# EAGLE design Adapter6 (EAGLE 7.7.0)
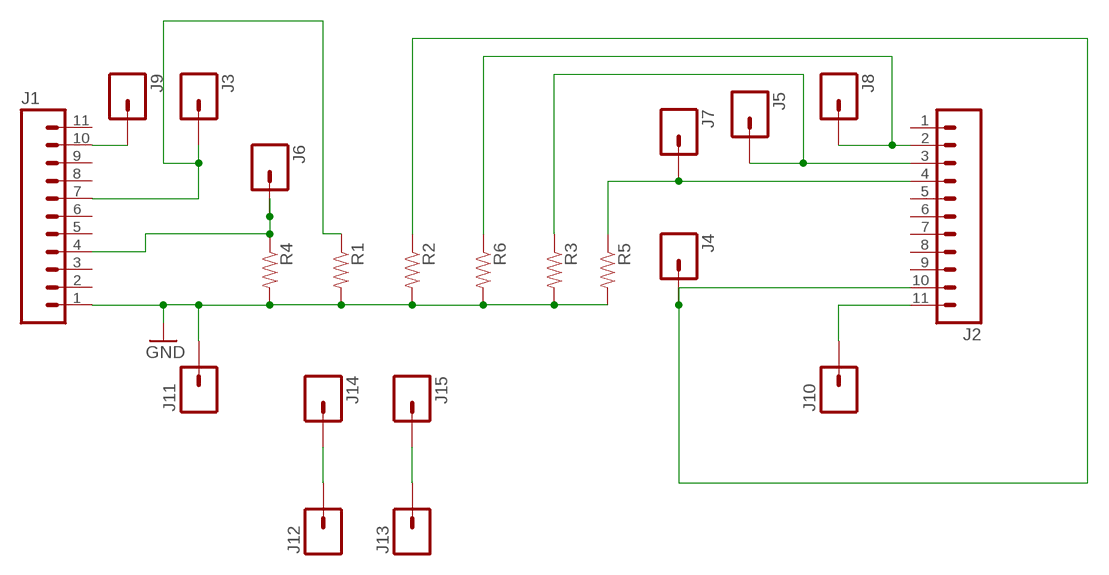
[diagram p0: schematic, sheet 1]

## Parts
J1  M11PTH  [1X11]
J2  M11PTH  [1X11]
J3  M01PTH_2MM  [1X01_2MM]
J4  M01PTH_2MM  [1X01_2MM]
J5  M01PTH_2MM  [1X01_2MM]
J6  M01PTH_2MM  [1X01_2MM]
J7  M01PTH_2MM  [1X01_2MM]
J8  M01PTH_2MM  [1X01_2MM]
J9  M01PTH_2MM  [1X01_2MM]
J10  M01PTH_NO_SILK_YES_STOP  [1X01_NO_SILK]
J11  M01PTH_NO_SILK_YES_STOP  [1X01_NO_SILK]
J12  M01PTH_2MM  [1X01_2MM]
J13  M01PTH_2MM  [1X01_2MM]
J14  M01PTH_NO_SILK_YES_STOP  [1X01_NO_SILK]
J15  M01PTH_NO_SILK_YES_STOP  [1X01_NO_SILK]
R1  RESISTOR1206  [1206]
R2  RESISTOR1206  [1206]
R3  RESISTOR1206  [1206]
R4  RESISTOR1206  [1206]
R5  RESISTOR1206  [1206]
R6  RESISTOR1206  [1206]

## Nets
GND: J1.1 J11.1 R1.2 R2.2 R3.2 R4.2 R5.2 R6.2
N$1: J2.10 J4.1 R2.1
N$2: J1.4 J6.1 R4.1
N$3: J2.11 J10.1
N$4: J2.4 J7.1 R5.1
N$5: J2.3 J5.1 R3.1
N$6: J2.2 J8.1 R6.1
N$7: J1.10 J9.1
N$8: J1.7 J3.1 R1.1
N$9: J12.1 J14.1
N$10: J13.1 J15.1
Unconnected: J1.2 J1.3 J1.5 J1.6 J1.8 J1.9 J1.11 J2.1 J2.5 J2.6 J2.7 J2.8 J2.9

## Library data of the parts
J1 J2 = SparkFun-Connectors:M11: Header 11 Standard 11-pin 0.1" header. Use with straight break away headers (SKU : PRT-00116), right angle break away headers (PRT-00553), swiss pins (PRT-00743), machine pins (PRT-00117), and female headers (PRT-00115).
J3-J15 = SparkFun-Connectors:M01: Header 1 Standard 1-pin 0.1" header. Use with straight break away headers (SKU : PRT-00116), right angle break away headers (PRT-00553), swiss pins (PRT-00743), machine pins (PRT-00117), and female headers (PRT-00115). SMTSO-256-ET is a "flush mount" nut for a 4-40 screw. The older package used to be too tight, and did not allow it to sit properly thru the drill hit. The latest (0.165DIA) fits nice and snug.
R1-R6 = SparkFun-Passives:RESISTOR: Resistor Basic schematic elements and footprints for 0603, 1206, and PTH resistors.

## Board
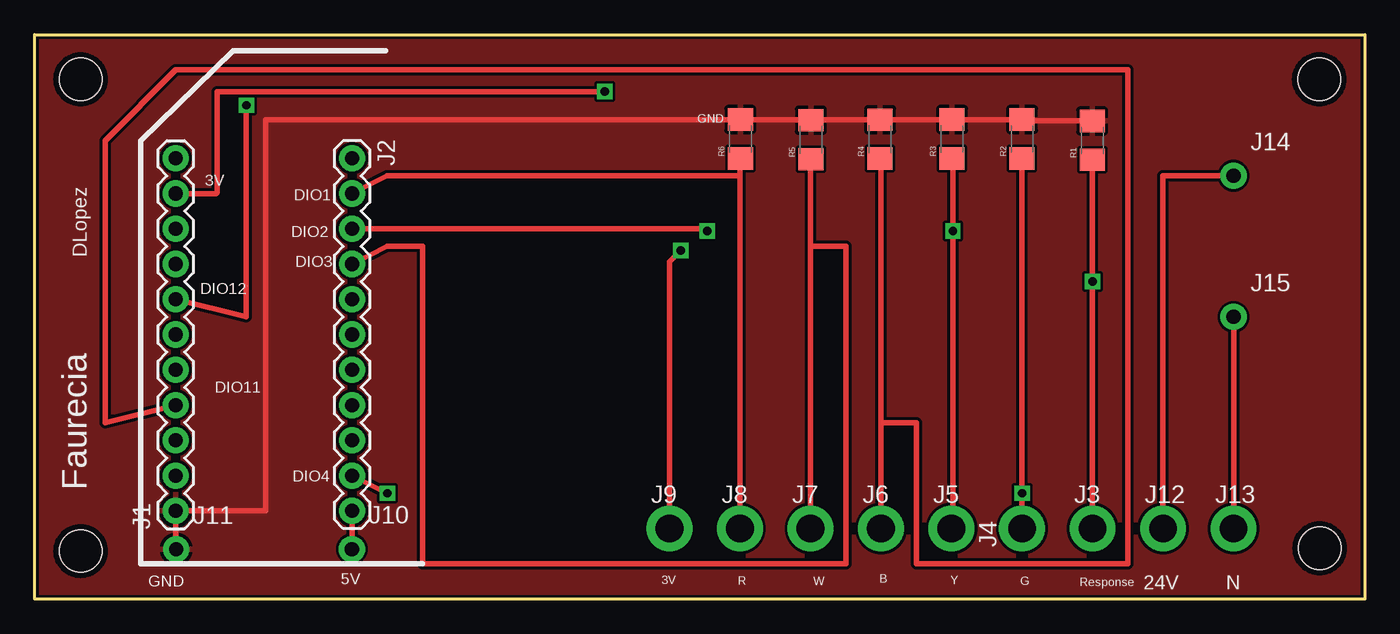
[diagram p1: board, top side]
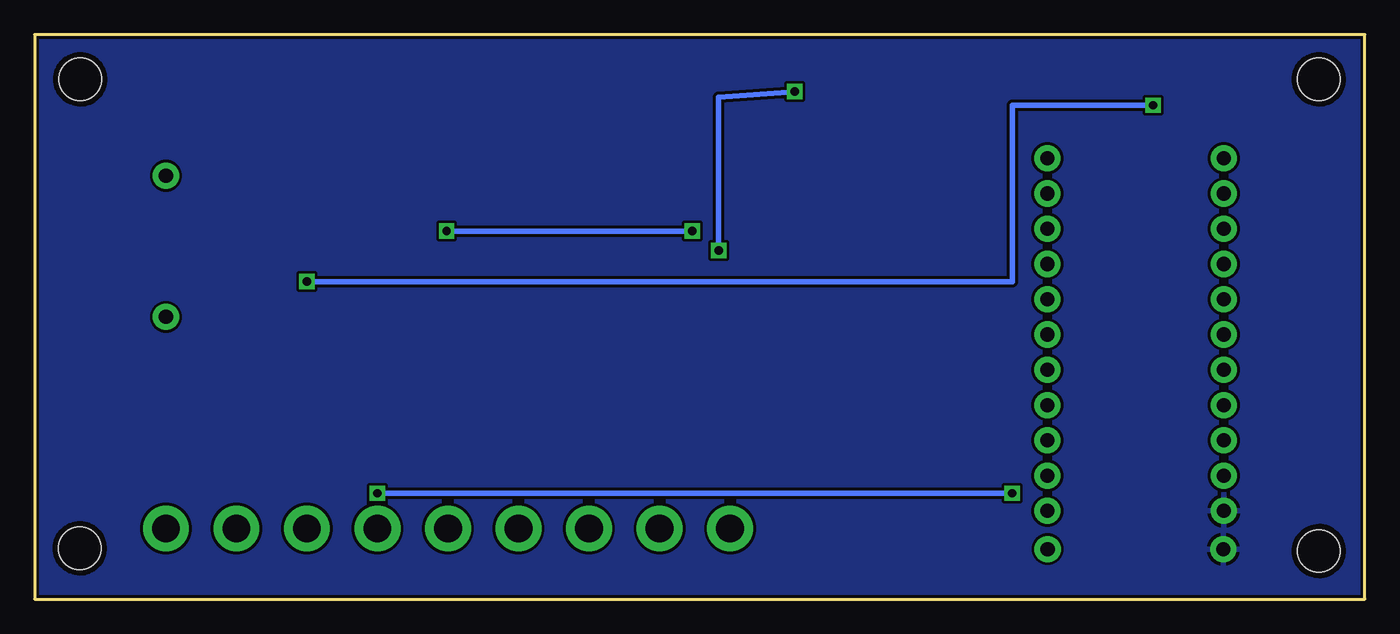
[diagram p2: board, bottom side, seen from below]

Size 95.81 x 40.64 mm. Coordinates in mm from the lower left corner, seen from the top.
Outline: 0,0 0,40.64 95.81,40.64 95.81,0 0,0
Copper layers (1*16): Top 0.035mm / dielectric 1.5mm / Bottom 0.035mm
Design rules "SparkFun": minimum track width 8mil, minimum drill 20mil, track to track 8mil, track to pad 8mil, pad to pad 8mil, via to via 8mil, smd to smd 8mil, copper to edge 8mil, drill to drill 8mil, minimum pad ring 12mil, minimum via ring 10mil, stop-mask expansion 4mil, vias tented up to drill 20mil, thermal gap 10mil

### Footprints (pad centres in the part's own frame; a part is rotated, then mirrored left to right if it is on the bottom)
1X11 = drill 1.016 pad 1.88: 1 0,0; 2 2.54,0; 3 5.08,0; 4 7.62,0; 5 10.16,0; 6 12.7,0; 7 15.24,0; 8 17.78,0; 9 20.32,0; 10 22.86,0; 11 25.4,0
1X01_2MM = drill 2 pad 3.302: 1 0,0
1X01_NO_SILK = drill 1.016 pad 1.88: 1 0,0
1206 = smd 1.6 x 1.8: 1 -1.4,0; 2 1.4,0
STAND-OFF-TIGHT = hole 3.048: 0,0

### Placement (x,y rotation side)
J1  10.16,6.35 90 top
J2  22.86,31.75 270 top
J3  76.2,5.08 0 top
J4  71.12,5.08 90 top
J5  66.04,5.08 0 top
J6  60.96,5.08 0 top
J7  55.88,5.08 0 top
J8  50.8,5.08 0 top
J9  45.72,5.08 0 top
J10  22.85,3.6 0 top
J11  10.19,3.58 0 top
J12  81.28,5.08 0 top
J13  86.36,5.08 0 top
J14  86.36,30.48 0 top
J15  86.36,20.32 0 top
R1  76.18,33.03 90 top
R2  71.12,33.13 90 top
R3  66.07,33.13 90 top
R4  60.88,33.12 90 top
R5  55.91,33.08 90 top
R6  50.83,33.13 90 top
U$1  [STAND-OFF-TIGHT]  3.31,37.43 0 top
U$2  [STAND-OFF-TIGHT]  3.31,3.46 0 top
U$3  [STAND-OFF-TIGHT]  92.53,37.43 0 top
U$4  [STAND-OFF-TIGHT]  92.56,3.66 0 top

### Tracks (layer width: path | path; a pad name or v marks a point on that pad's centre or on a via)
GND
  Top 0.406: R6.2 R4.2 55.8,34.53 R3.2 R2.2 71.12,34.43 R1.2 | R6.2 16.65,34.5 16.65,6.35 J1.1 10.16,3.61 J11.1
  pour Top: 0,0 0,40.64 95.77,40.64 95.82,0
  pour Bottom: 0,0 0,40.64 95.77,40.64 95.82,0
N$1  (via drill 0.6)
  Top 0.406: R2.1 v71.12,7.62 J4.1 | v25.4,7.62 J2.10
  Bottom 0.406: v71.12,7.62 v25.4,7.62
N$2
  Top 0.406: 60.96,12.7 60.96,31.72 R4.1 | 60.96,12.7 63.5,12.7 63.5,2.54 78.74,2.54 78.74,38.1 10.16,38.1 5.08,33.02 5.08,12.7 J1.4 | J6.1 60.96,12.7
N$3
  Top 0.406: J2.11 J10.1
N$4
  Top 0.406: R5.1 55.88,31.68 55.88,25.4 | 55.88,25.4 58.42,25.4 58.42,2.54 27.94,2.54 27.94,25.4 25.4,25.4 J2.4 | J7.1 55.88,25.4
N$5  (via drill 0.6)
  Top 0.406: R3.1 66.04,31.73 66.14,31.63 v66.14,26.5 | v48.44,26.5 48.27,26.67 J2.3 | v66.14,26.5 66.04,26.4 | J5.1 66.14,5.08 v66.14,26.5
  Bottom 0.406: v66.14,26.5 v48.44,26.5
N$6
  Top 0.406: 22.86,29 J2.2 25.4,30.48 50.8,30.48 | 50.8,30.48 50.8,31.73 R6.1 | J8.1 50.8,30.48
N$7  (via drill 0.6)
  Top 0.406: J1.10 13.05,29.2 13.15,29.3 13.15,36.55 v41.06,36.55 | v46.54,25.1 45.72,24.28 J9.1
  Bottom 0.406: v41.06,36.55 46.54,36.15 v46.54,25.1
N$8  (via drill 0.6)
  Top 0.406: R1.1 v76.2,22.86 J3.1 | v15.24,35.56 15.24,20.32 J1.7
  Bottom 0.406: v76.2,22.86 25.4,22.86 25.4,35.56 v15.24,35.56
N$9
  Top 0.406: J14.1 81.28,30.48 J12.1
N$10
  Top 0.406: J13.1 J15.1

### Text on the board
tPlace: 3V | DIO1 | DIO2 | DLopez | DIO3 | DIO11 | Faurecia | DIO4 | GND | 5V
tNames: GND | DIO12 | 3V | R | W | B | Y | G | Response | 24V | N